# EAGLE schematic Pulsar 1.6 (EAGLE 5.11)

## Sheet 1 of 6
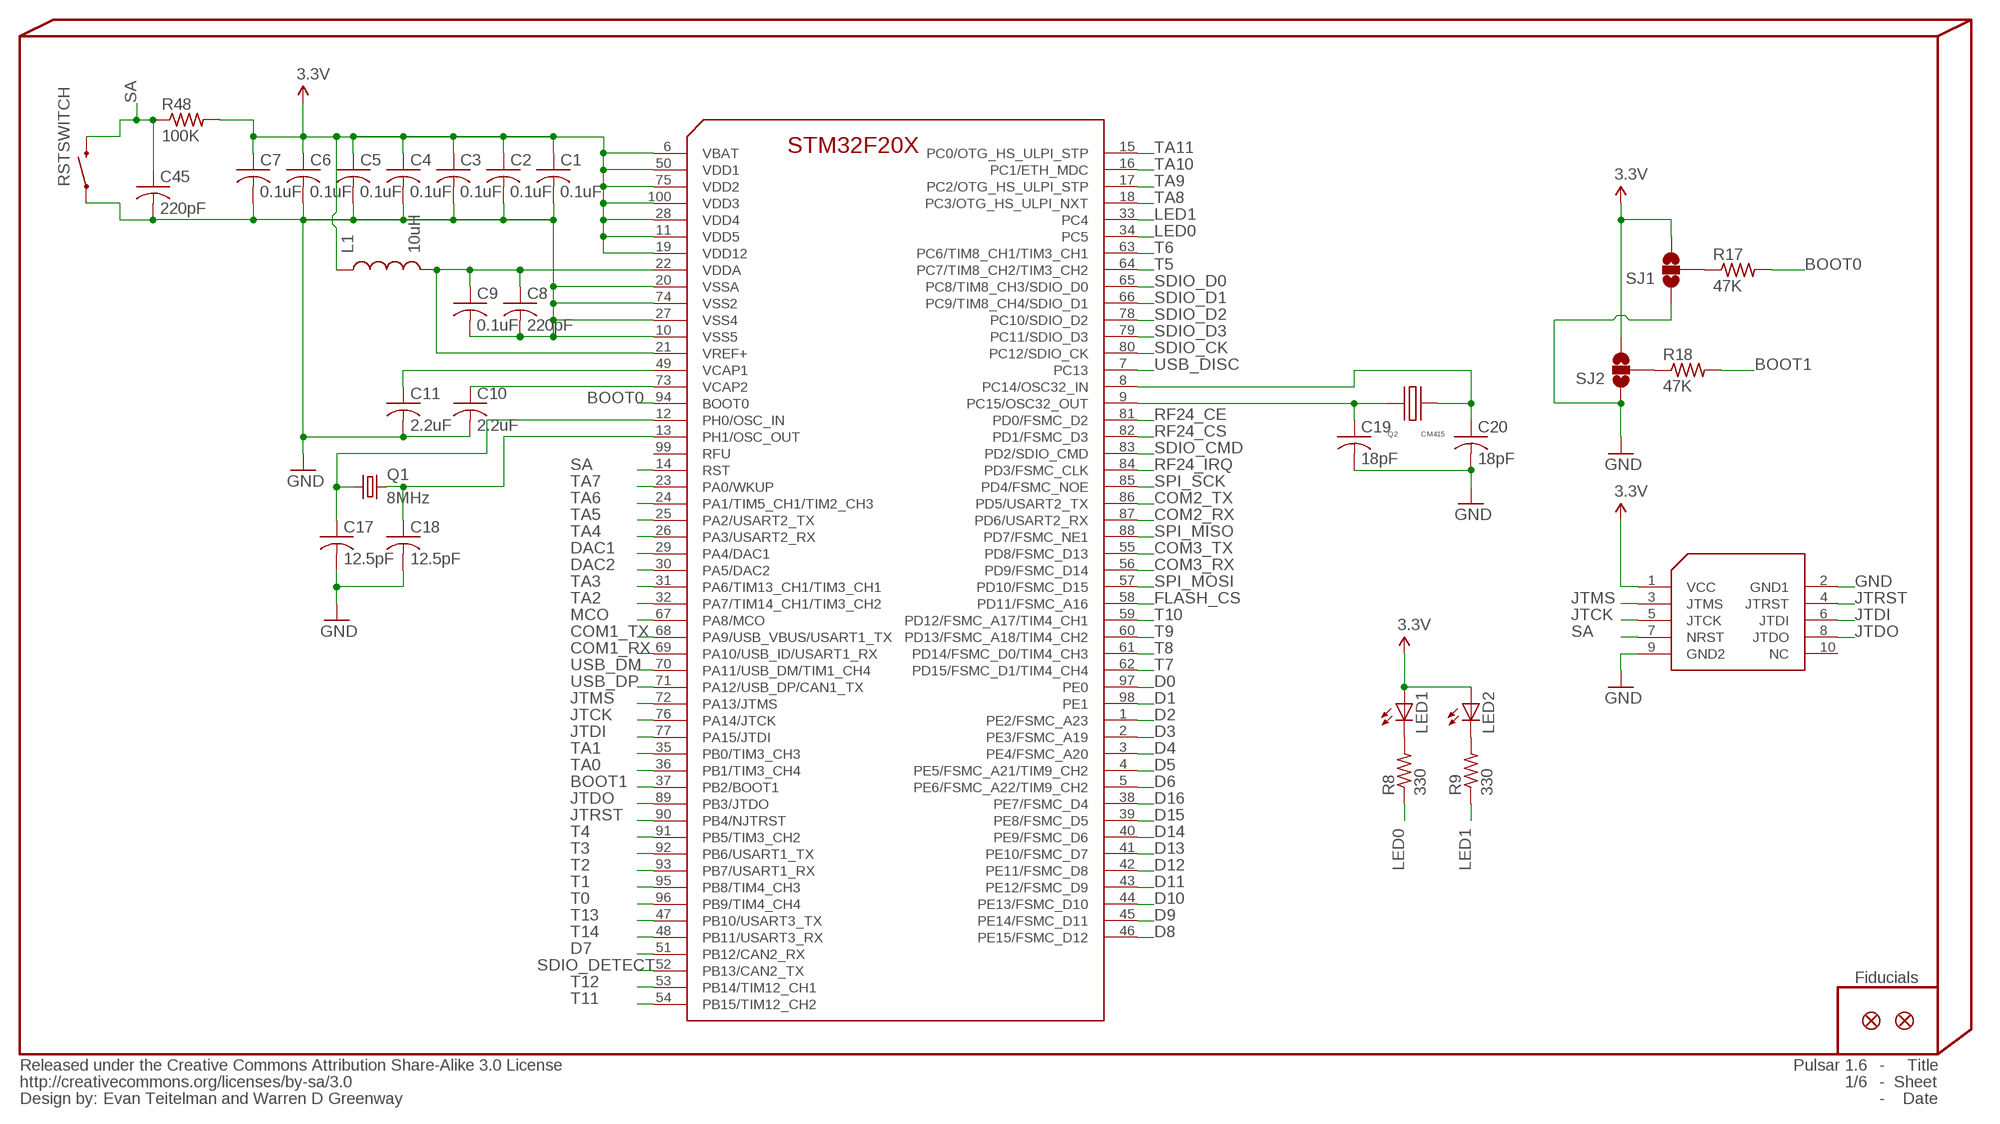
[diagram p0: schematic, sheet 1]

### Parts
C1  0.1uF  C-USC0402  [C0402]
C2  0.1uF  C-USC0402  [C0402]
C3  0.1uF  C-USC0402  [C0402]
C4  0.1uF  C-USC0402  [C0402]
C5  0.1uF  C-USC0402  [C0402]
C6  0.1uF  C-USC0402  [C0402]
C7  0.1uF  C-USC0402  [C0402]
C8  220pF  C-USC0402  [C0402]
C9  0.1uF  C-USC0402  [C0402]
C10  2.2uF  C-USC0402  [C0402]
C11  2.2uF  C-USC0402  [C0402]
C17  12.5pF  C-USC0402  [C0402]
C18  12.5pF  C-USC0402  [C0402]
C19  18pF  C-USC0402  [C0402]
C20  18pF  C-USC0402  [C0402]
C45  220pF  C-USC0402  [C0402]
INFO12  Evan Teitelman and Warren D Greenway  CC-BY-SA  [CC-BY-SA]
JP1  FIDUCIAL1.5X3  [FIDUCIAL-1.5X3]
JP2  FIDUCIAL1.5X3  [FIDUCIAL-1.5X3]
L1  10uH  INDUCTOR0805  [0805]
LED1  LED0603  [LED-0603]
LED2  LED0603  [LED-0603]
Q1  8MHz  CRYSTAL5X3  [CRYSTAL-SMD-5X3]
Q2  CM415  [CM415]
R8  330  R-US_R0402  [R0402]
R9  330  R-US_R0402  [R0402]
R17  47K  R-US_R0402  [R0402]
R18  47K  R-US_R0402  [R0402]
R48  100K  R-US_R0402  [R0402]
RSTSWITCH  SWITCH-MOMENTARY-2SMD  [TACTILE_SWITCH_SMD]
SJ1  SOLDERJUMPER_2WAYS  [SJ_3]
SJ2  SOLDERJUMPER_2WAYS  [SJ_3]
U1  STM32F205VG  [TQFP100]
U5  STM32-JTAG-10P  [STM32-JTAG-10P]

### Nets
3.3V: C1.1 C2.1 C3.1 C4.1 C5.1 C6.1 C7.1 L1.1 LED1.A LED2.A R48.2 SJ1.3 SJ2.3 U1.6(VBAT) U1.11(VDD5) U1.19(VDD12) U1.28(VDD4) U1.50(VDD1) U1.75(VDD2) U1.100(VDD3) U5.1(VCC) ; also sheet 2,3,4,5
BOOT0: R17.2 U1.94(BOOT0) ; also sheet 3
BOOT1: R18.2 U1.37(PB2/BOOT1) ; also sheet 3
COM1_RX: U1.69(PA10/USB_ID/USART1_RX) ; also sheet 3
COM1_TX: U1.68(PA9/USB_VBUS/USART1_TX) ; also sheet 3
COM2_RX: U1.87(PD6/USART2_RX) ; also sheet 3
COM2_TX: U1.86(PD5/USART2_TX) ; also sheet 3
COM3_RX: U1.56(PD9/FSMC_D14) ; also sheet 3
COM3_TX: U1.55(PD8/FSMC_D13) ; also sheet 3
D0: U1.97(PE0) ; also sheet 3
D1: U1.98(PE1) ; also sheet 3
D2: U1.1(PE2/FSMC_A23) ; also sheet 3
D3: U1.2(PE3/FSMC_A19) ; also sheet 3
D4: U1.3(PE4/FSMC_A20) ; also sheet 3
D5: U1.4(PE5/FSMC_A21/TIM9_CH2) ; also sheet 3
D6: U1.5(PE6/FSMC_A22/TIM9_CH2) ; also sheet 3
D7: U1.51(PB12/CAN2_RX) ; also sheet 3
D8: U1.46(PE15/FSMC_D12) ; also sheet 3
D9: U1.45(PE14/FSMC_D11) ; also sheet 3
D10: U1.44(PE13/FSMC_D10) ; also sheet 3
D11: U1.43(PE12/FSMC_D9) ; also sheet 3
D12: U1.42(PE11/FSMC_D8) ; also sheet 3
D13: U1.41(PE10/FSMC_D7) ; also sheet 3
D14: U1.40(PE9/FSMC_D6) ; also sheet 3
D15: U1.39(PE8/FSMC_D5) ; also sheet 3
D16: U1.38(PE7/FSMC_D4) ; also sheet 3
DAC1: U1.29(PA4/DAC1) ; also sheet 3
DAC2: U1.30(PA5/DAC2) ; also sheet 3
FLASH_CS: U1.58(PD11/FSMC_A16) ; also sheet 4
GND: C1.2 C2.2 C3.2 C4.2 C5.2 C6.2 C7.2 C8.2 C9.2 C10.2 C11.2 C17.2 C18.2 C19.2 C20.2 C45.2 RSTSWITCH.1 SJ1.1 SJ2.1 U1.10(VSS5) U1.20(VSSA) U1.27(VSS4) U1.74(VSS2) U5.2(GND1) U5.9(GND2) ; also sheet 2,3,4,5
JTCK: U1.76(PA14/JTCK) U5.5(JTCK) ; also sheet 3
JTDI: U1.77(PA15/JTDI) U5.6(JTDI) ; also sheet 3
JTDO: U1.89(PB3/JTDO) U5.8(JTDO) ; also sheet 3
JTMS: U1.72(PA13/JTMS) U5.3(JTMS) ; also sheet 3
JTRST: U1.90(PB4/NJTRST) U5.4(JTRST) ; also sheet 3
LED0: R8.1 U1.34(PC5)
LED1: R9.1 U1.33(PC4)
MCO: U1.67(PA8/MCO) ; also sheet 3
N$1: C17.1 Q1.1 U1.12(PH0/OSC_IN)
N$2: C8.1 C9.1 L1.2 U1.21(VREF+) U1.22(VDDA)
N$3: C18.1 Q1.3 U1.13(PH1/OSC_OUT)
N$6: C11.1 U1.49(VCAP1)
N$7: C10.1 U1.73(VCAP2)
N$8: C20.1 Q2.P$2(XOUT) U1.8(PC14/OSC32_IN)
N$9: C19.1 Q2.P$1(XIN) U1.9(PC15/OSC32_OUT)
N$10: LED1.C R8.2
N$12: LED2.C R9.2
N$30: R17.1 SJ1.2
N$31: R18.1 SJ2.2
RF24_CE: U1.81(PD0/FSMC_D2) ; also sheet 2
RF24_CS: U1.82(PD1/FSMC_D3) ; also sheet 2
RF24_IRQ: U1.84(PD3/FSMC_CLK) ; also sheet 2
SA: C45.1 R48.1 RSTSWITCH.3 U1.14(RST) U5.7(NRST) ; also sheet 3
SDIO_CK: U1.80(PC12/SDIO_CK) ; also sheet 4
SDIO_CMD: U1.83(PD2/SDIO_CMD) ; also sheet 4
SDIO_D0: U1.65(PC8/TIM8_CH3/SDIO_D0) ; also sheet 4
SDIO_D1: U1.66(PC9/TIM8_CH4/SDIO_D1) ; also sheet 4
SDIO_D2: U1.78(PC10/SDIO_D2) ; also sheet 4
SDIO_D3: U1.79(PC11/SDIO_D3) ; also sheet 4
SDIO_DETECT: U1.52(PB13/CAN2_TX) ; also sheet 4
SPI_MISO: U1.88(PD7/FSMC_NE1) ; also sheet 2,4
SPI_MOSI: U1.57(PD10/FSMC_D15) ; also sheet 2,4
SPI_SCK: U1.85(PD4/FSMC_NOE) ; also sheet 2,4
T0: U1.96(PB9/TIM4_CH4) ; also sheet 3
T1: U1.95(PB8/TIM4_CH3) ; also sheet 3
T2: U1.93(PB7/USART1_RX) ; also sheet 3
T3: U1.92(PB6/USART1_TX) ; also sheet 3
T4: U1.91(PB5/TIM3_CH2) ; also sheet 3
T5: U1.64(PC7/TIM8_CH2/TIM3_CH2) ; also sheet 3
T6: U1.63(PC6/TIM8_CH1/TIM3_CH1) ; also sheet 3
T7: U1.62(PD15/FSMC_D1/TIM4_CH4) ; also sheet 3
T8: U1.61(PD14/FSMC_D0/TIM4_CH3) ; also sheet 3
T9: U1.60(PD13/FSMC_A18/TIM4_CH2) ; also sheet 3
T10: U1.59(PD12/FSMC_A17/TIM4_CH1) ; also sheet 3
T11: U1.54(PB15/TIM12_CH2) ; also sheet 3
T12: U1.53(PB14/TIM12_CH1) ; also sheet 3
T13: U1.47(PB10/USART3_TX) ; also sheet 3
T14: U1.48(PB11/USART3_RX) ; also sheet 3
TA0: U1.36(PB1/TIM3_CH4) ; also sheet 3
TA1: U1.35(PB0/TIM3_CH3) ; also sheet 3
TA2: U1.32(PA7/TIM14_CH1/TIM3_CH2) ; also sheet 3
TA3: U1.31(PA6/TIM13_CH1/TIM3_CH1) ; also sheet 3
TA4: U1.26(PA3/USART2_RX) ; also sheet 3
TA5: U1.25(PA2/USART2_TX) ; also sheet 3
TA6: U1.24(PA1/TIM5_CH1/TIM2_CH3) ; also sheet 3
TA7: U1.23(PA0/WKUP) ; also sheet 3
TA8: U1.18(PC3/OTG_HS_ULPI_NXT) ; also sheet 3
TA9: U1.17(PC2/OTG_HS_ULPI_STP) ; also sheet 3
TA10: U1.16(PC1/ETH_MDC) ; also sheet 3
TA11: U1.15(PC0/OTG_HS_ULPI_STP) ; also sheet 3
USB_DISC: U1.7(PC13) ; also sheet 3,4
USB_DM: U1.70(PA11/USB_DM/TIM1_CH4) ; also sheet 3,4
USB_DP: U1.71(PA12/USB_DP/CAN1_TX) ; also sheet 3,4
Unconnected: U1.99(RFU) U5.10(NC)

### Notes on the sheet
- Fiducials

## Sheet 2 of 6
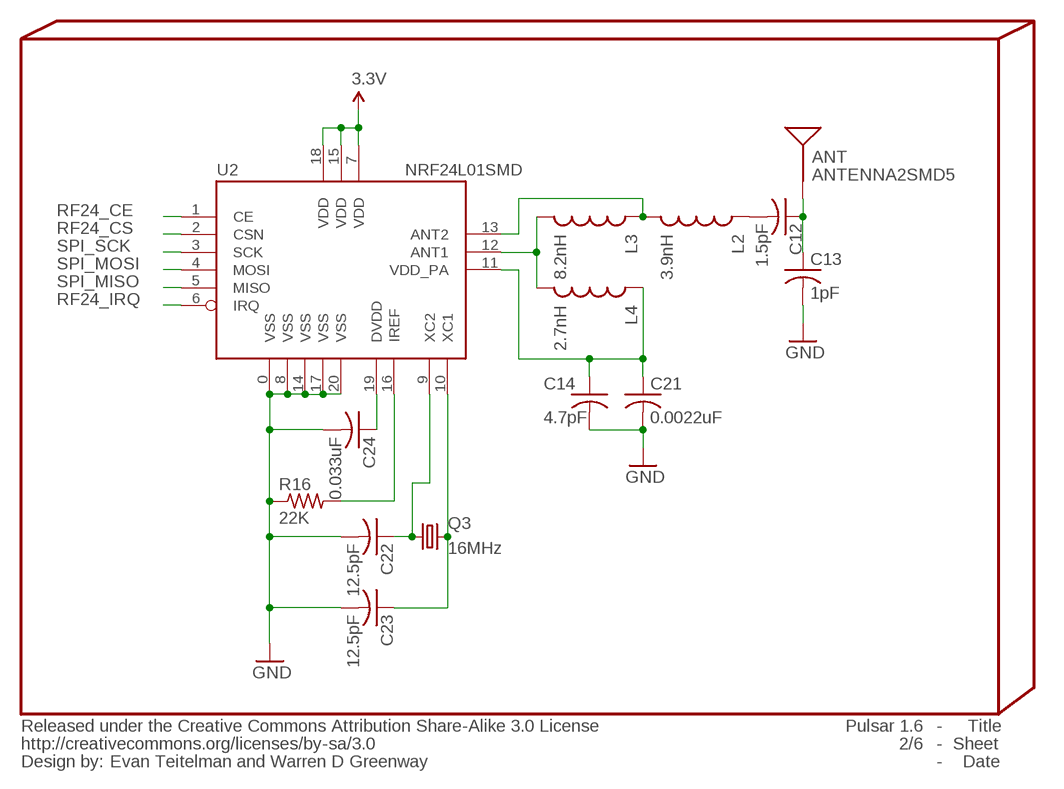
[diagram p1: schematic, sheet 2]

### Parts
ANT  ANTENNA2SMD5  [ANTENNA-CHIP5]
C12  1.5pF  C-USC0402  [C0402]
C13  1pF  C-USC0402  [C0402]
C14  4.7pF  C-USC0402  [C0402]
C21  0.0022uF  C-USC0402  [C0402]
C22  12.5pF  C-USC0402  [C0402]
C23  12.5pF  C-USC0402  [C0402]
C24  0.033uF  C-USC0402  [C0402]
L2  3.9nH  INDUCTOR0603  [0603]
L3  8.2nH  INDUCTOR0603  [0603]
L4  2.7nH  INDUCTOR0603  [0603]
Q3  16MHz  CRYSTAL5X3  [CRYSTAL-SMD-5X3]
R16  22K  R-US_R0402  [R0402]
U2  NRF24L01SMD  [QFN20]

### Nets
3.3V: U2.7(VDD) U2.15(VDD) U2.18(VDD) ; also sheet 1,3,4,5
GND: C13.2 C14.2 C21.2 C22.2 C23.2 C24.2 R16.1 U2.0(VSS) U2.8(VSS) U2.14(VSS) U2.17(VSS) U2.20(VSS) ; also sheet 1,3,4,5
N$17: C12.2 L2.1
N$18: L3.2 L4.2 U2.12(ANT1)
N$19: ANT.FEED(SIGNAL) C12.1 C13.1
N$20: L2.2 L3.1 U2.13(ANT2)
N$21: C14.1 C21.1 L4.1 U2.11(VDD_PA)
N$23: R16.2 U2.16(IREF)
N$24: C24.1 U2.19(DVDD)
N$26: C22.1 Q3.1 U2.9(XC2)
N$27: C23.1 Q3.3 U2.10(XC1)
RF24_CE: U2.1(CE) ; also sheet 1
RF24_CS: U2.2(CSN) ; also sheet 1
RF24_IRQ: U2.6(IRQ) ; also sheet 1
SPI_MISO: U2.5(MISO) ; also sheet 1,4
SPI_MOSI: U2.4(MOSI) ; also sheet 1,4
SPI_SCK: U2.3(SCK) ; also sheet 1,4

## Sheet 3 of 6
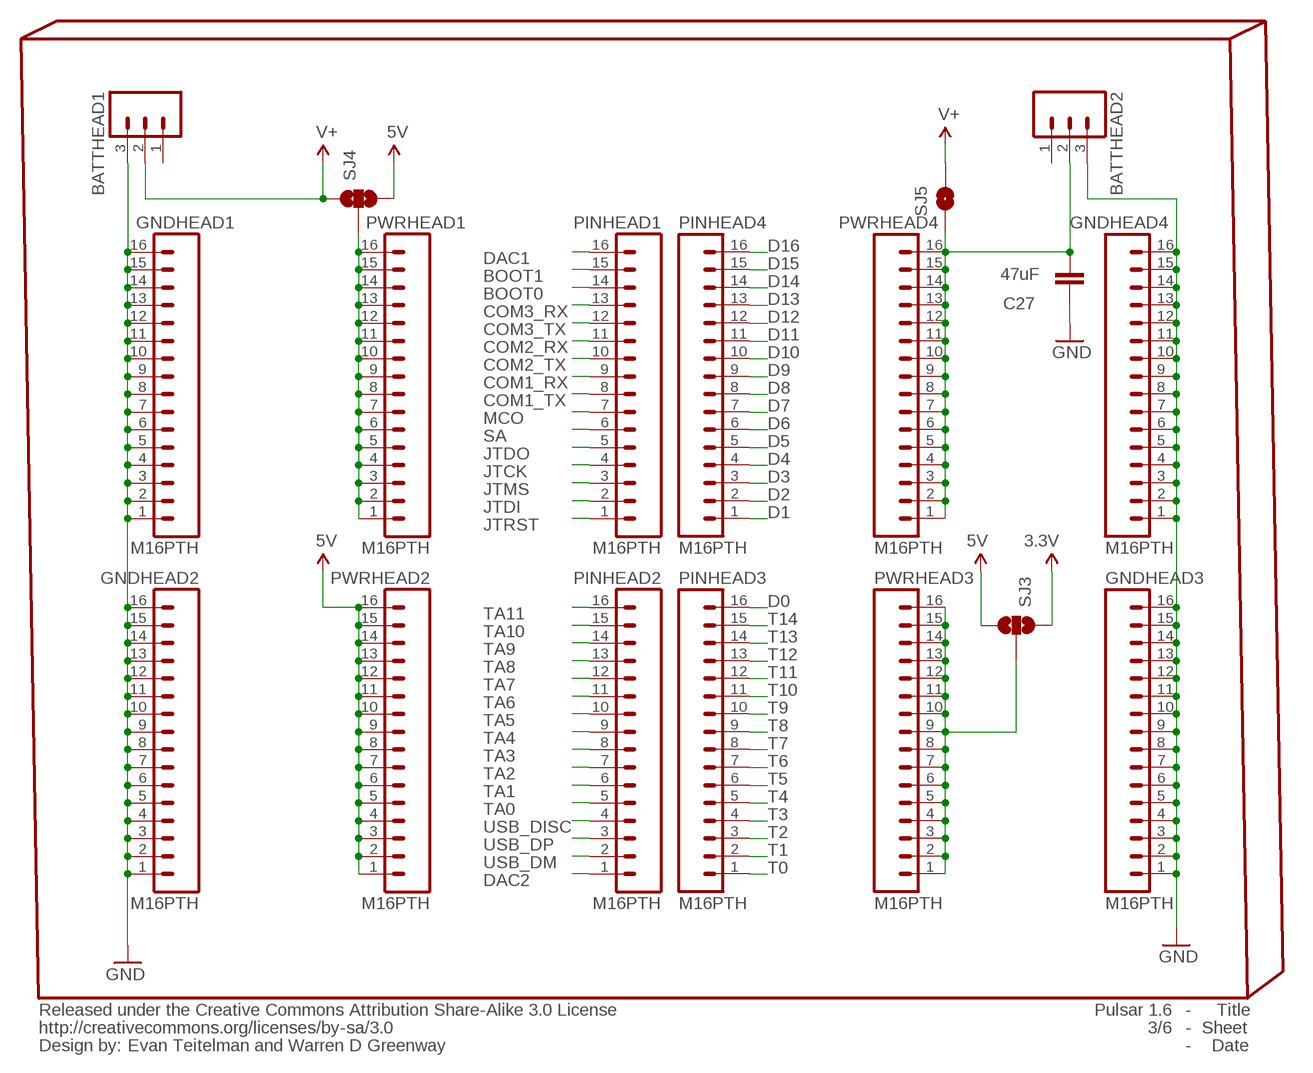
[diagram p2: schematic, sheet 3]

### Parts
BATTHEAD1  M03PTH  [1X03]
BATTHEAD2  M03PTH  [1X03]
C27  47uF  CAP1206  [1206]
GNDHEAD1  M16PTH  [1X16]
GNDHEAD2  M16PTH  [1X16]
GNDHEAD3  M16PTH  [1X16]
GNDHEAD4  M16PTH  [1X16]
PINHEAD1  M16PTH  [1X16]
PINHEAD2  M16PTH  [1X16]
PINHEAD3  M16PTH  [1X16]
PINHEAD4  M16PTH  [1X16]
PWRHEAD1  M16PTH  [1X16]
PWRHEAD2  M16PTH  [1X16]
PWRHEAD3  M16PTH  [1X16]
PWRHEAD4  M16PTH  [1X16]
SJ3  SOLDERJUMPER_2WAYPASTE1&2  [SJ_3_PASTE1&2]
SJ4  SOLDERJUMPER_2WAYPASTE1&2  [SJ_3_PASTE1&2]
SJ5  SOLDERJUMPERNO  [SJ_2S-NO]

### Nets
3.3V: SJ3.1 ; also sheet 1,2,4,5
5V: PWRHEAD2.1 PWRHEAD2.2 PWRHEAD2.3 PWRHEAD2.4 PWRHEAD2.5 PWRHEAD2.6 PWRHEAD2.7 PWRHEAD2.8 PWRHEAD2.9 PWRHEAD2.10 PWRHEAD2.11 PWRHEAD2.12 PWRHEAD2.13 PWRHEAD2.14 PWRHEAD2.15 PWRHEAD2.16 SJ3.3 SJ4.3 ; also sheet 4,5
BOOT0: PINHEAD1.14 ; also sheet 1
BOOT1: PINHEAD1.15 ; also sheet 1
COM1_RX: PINHEAD1.9 ; also sheet 1
COM1_TX: PINHEAD1.8 ; also sheet 1
COM2_RX: PINHEAD1.11 ; also sheet 1
COM2_TX: PINHEAD1.10 ; also sheet 1
COM3_RX: PINHEAD1.13 ; also sheet 1
COM3_TX: PINHEAD1.12 ; also sheet 1
D0: PINHEAD3.16 ; also sheet 1
D1: PINHEAD4.1 ; also sheet 1
D2: PINHEAD4.2 ; also sheet 1
D3: PINHEAD4.3 ; also sheet 1
D4: PINHEAD4.4 ; also sheet 1
D5: PINHEAD4.5 ; also sheet 1
D6: PINHEAD4.6 ; also sheet 1
D7: PINHEAD4.7 ; also sheet 1
D8: PINHEAD4.8 ; also sheet 1
D9: PINHEAD4.9 ; also sheet 1
D10: PINHEAD4.10 ; also sheet 1
D11: PINHEAD4.11 ; also sheet 1
D12: PINHEAD4.12 ; also sheet 1
D13: PINHEAD4.13 ; also sheet 1
D14: PINHEAD4.14 ; also sheet 1
D15: PINHEAD4.15 ; also sheet 1
D16: PINHEAD4.16 ; also sheet 1
DAC1: PINHEAD1.16 ; also sheet 1
DAC2: PINHEAD2.1 ; also sheet 1
GND: BATTHEAD1.3 BATTHEAD2.3 C27.2 GNDHEAD1.1 GNDHEAD1.2 GNDHEAD1.3 GNDHEAD1.4 GNDHEAD1.5 GNDHEAD1.6 GNDHEAD1.7 GNDHEAD1.8 GNDHEAD1.9 GNDHEAD1.10 GNDHEAD1.11 GNDHEAD1.12 GNDHEAD1.13 GNDHEAD1.14 GNDHEAD1.15 GNDHEAD1.16 GNDHEAD2.1 GNDHEAD2.2 GNDHEAD2.3 GNDHEAD2.4 GNDHEAD2.5 GNDHEAD2.6 GNDHEAD2.7 GNDHEAD2.8 GNDHEAD2.9 GNDHEAD2.10 GNDHEAD2.11 GNDHEAD2.12 GNDHEAD2.13 GNDHEAD2.14 GNDHEAD2.15 GNDHEAD2.16 GNDHEAD3.1 GNDHEAD3.2 GNDHEAD3.3 GNDHEAD3.4 GNDHEAD3.5 GNDHEAD3.6 GNDHEAD3.7 GNDHEAD3.8 GNDHEAD3.9 GNDHEAD3.10 GNDHEAD3.11 GNDHEAD3.12 GNDHEAD3.13 GNDHEAD3.14 GNDHEAD3.15 GNDHEAD3.16 GNDHEAD4.1 GNDHEAD4.2 GNDHEAD4.3 GNDHEAD4.4 GNDHEAD4.5 GNDHEAD4.6 GNDHEAD4.7 GNDHEAD4.8 GNDHEAD4.9 GNDHEAD4.10 GNDHEAD4.11 GNDHEAD4.12 GNDHEAD4.13 GNDHEAD4.14 GNDHEAD4.15 GNDHEAD4.16 ; also sheet 1,2,4,5
JTCK: PINHEAD1.4 ; also sheet 1
JTDI: PINHEAD1.2 ; also sheet 1
JTDO: PINHEAD1.5 ; also sheet 1
JTMS: PINHEAD1.3 ; also sheet 1
JTRST: PINHEAD1.1 ; also sheet 1
MCO: PINHEAD1.7 ; also sheet 1
PH1LINE: PWRHEAD1.1 PWRHEAD1.2 PWRHEAD1.3 PWRHEAD1.4 PWRHEAD1.5 PWRHEAD1.6 PWRHEAD1.7 PWRHEAD1.8 PWRHEAD1.9 PWRHEAD1.10 PWRHEAD1.11 PWRHEAD1.12 PWRHEAD1.13 PWRHEAD1.14 PWRHEAD1.15 PWRHEAD1.16 SJ4.2
PH3LINE: PWRHEAD3.1 PWRHEAD3.2 PWRHEAD3.3 PWRHEAD3.4 PWRHEAD3.5 PWRHEAD3.6 PWRHEAD3.7 PWRHEAD3.8 PWRHEAD3.9 PWRHEAD3.10 PWRHEAD3.11 PWRHEAD3.12 PWRHEAD3.13 PWRHEAD3.14 PWRHEAD3.15 PWRHEAD3.16 SJ3.2
PH4LINE: BATTHEAD2.2 C27.1 PWRHEAD4.1 PWRHEAD4.2 PWRHEAD4.3 PWRHEAD4.4 PWRHEAD4.5 PWRHEAD4.6 PWRHEAD4.7 PWRHEAD4.8 PWRHEAD4.9 PWRHEAD4.10 PWRHEAD4.11 PWRHEAD4.12 PWRHEAD4.13 PWRHEAD4.14 PWRHEAD4.15 PWRHEAD4.16 SJ5.1
SA: PINHEAD1.6 ; also sheet 1
T0: PINHEAD3.1 ; also sheet 1
T1: PINHEAD3.2 ; also sheet 1
T2: PINHEAD3.3 ; also sheet 1
T3: PINHEAD3.4 ; also sheet 1
T4: PINHEAD3.5 ; also sheet 1
T5: PINHEAD3.6 ; also sheet 1
T6: PINHEAD3.7 ; also sheet 1
T7: PINHEAD3.8 ; also sheet 1
T8: PINHEAD3.9 ; also sheet 1
T9: PINHEAD3.10 ; also sheet 1
T10: PINHEAD3.11 ; also sheet 1
T11: PINHEAD3.12 ; also sheet 1
T12: PINHEAD3.13 ; also sheet 1
T13: PINHEAD3.14 ; also sheet 1
T14: PINHEAD3.15 ; also sheet 1
TA0: PINHEAD2.5 ; also sheet 1
TA1: PINHEAD2.6 ; also sheet 1
TA2: PINHEAD2.7 ; also sheet 1
TA3: PINHEAD2.8 ; also sheet 1
TA4: PINHEAD2.9 ; also sheet 1
TA5: PINHEAD2.10 ; also sheet 1
TA6: PINHEAD2.11 ; also sheet 1
TA7: PINHEAD2.12 ; also sheet 1
TA8: PINHEAD2.13 ; also sheet 1
TA9: PINHEAD2.14 ; also sheet 1
TA10: PINHEAD2.15 ; also sheet 1
TA11: PINHEAD2.16 ; also sheet 1
USB_DISC: PINHEAD2.4 ; also sheet 1,4
USB_DM: PINHEAD2.2 ; also sheet 1,4
USB_DP: PINHEAD2.3 ; also sheet 1,4
V+: BATTHEAD1.2 SJ4.1 SJ5.2 ; also sheet 5
Unconnected: BATTHEAD1.1 BATTHEAD2.1

## Sheet 4 of 6
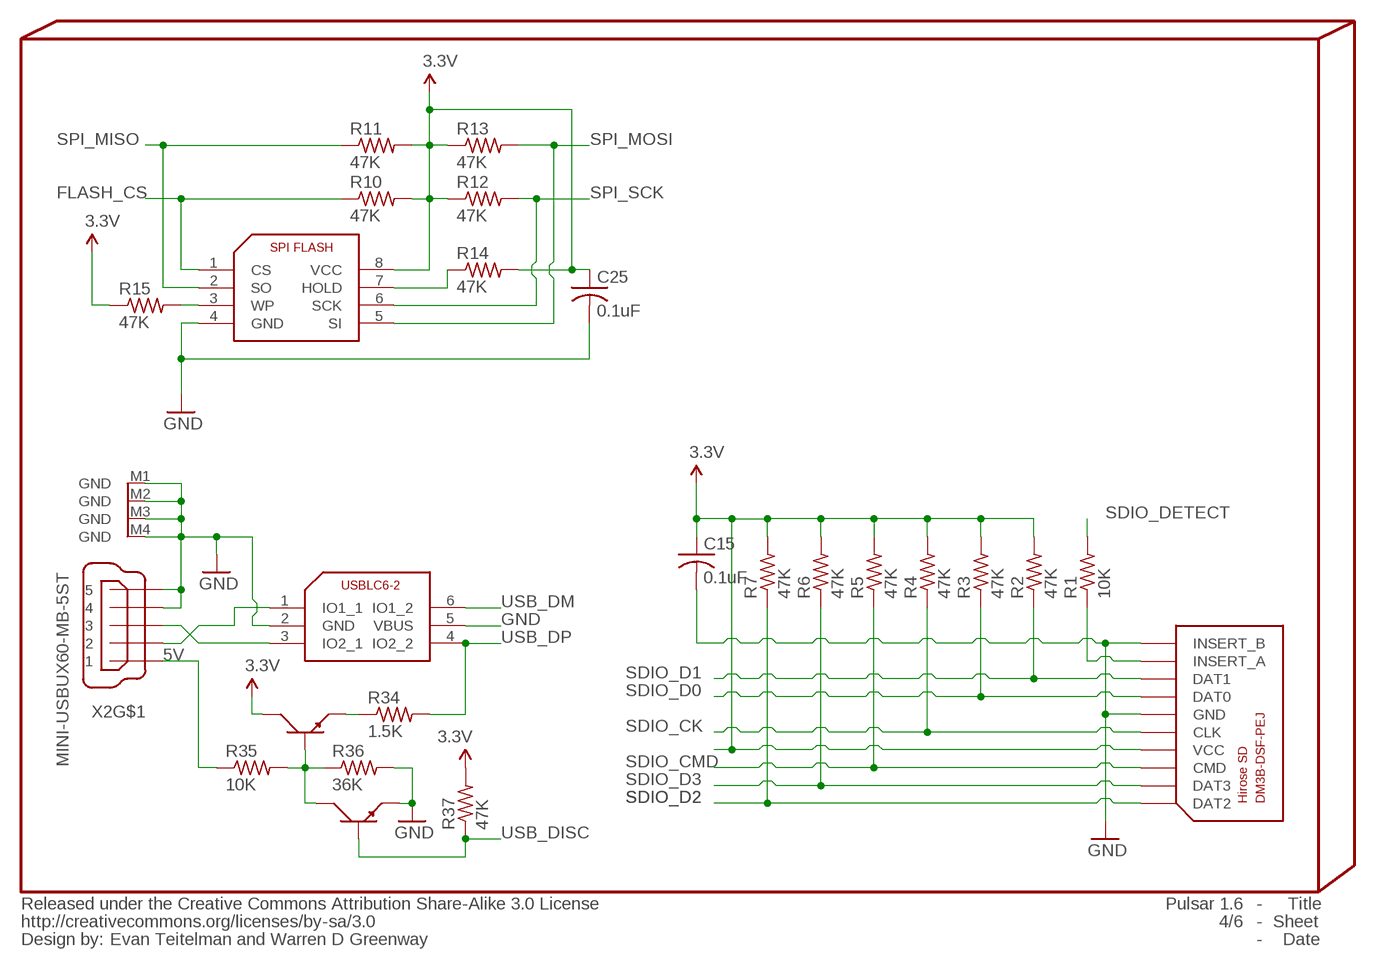
[diagram p3: schematic, sheet 4]

### Parts
C15  0.1uF  C-USC0402  [C0402]
C25  0.1uF  C-USC0402  [C0402]
R1  10K  R-US_R0402  [R0402]
R2  47K  R-US_R0402  [R0402]
R3  47K  R-US_R0402  [R0402]
R4  47K  R-US_R0402  [R0402]
R5  47K  R-US_R0402  [R0402]
R6  47K  R-US_R0402  [R0402]
R7  47K  R-US_R0402  [R0402]
R10  47K  R-US_R0402  [R0402]
R11  47K  R-US_R0402  [R0402]
R12  47K  R-US_R0402  [R0402]
R13  47K  R-US_R0402  [R0402]
R14  47K  R-US_R0402  [R0402]
R15  47K  R-US_R0402  [R0402]
R34  1.5K  R-US_R0402  [R0402]
R35  10K  R-US_R0402  [R0402]
R36  36K  R-US_R0402  [R0402]
R37  47K  R-US_R0402  [R0402]
U3  SST25VF080B  [DUBLIB_SOIC8]
U4  USBLC6-2  [SOT23-6L]
U6  HIROSE-SDCARD-DM3B-DSF-PEJ  [HIROSE-SDCARD-DM3B-DSF-PEJ]
U$23  PMBT6428  [SOT23]
U$24  PMBT6428  [SOT23]
X2  MINI-USBUX60-MB-5ST  [DUBLIB_UX60-MB-5ST]

### Nets
3.3V: C15.1 C25.1 R2.2 R3.2 R4.2 R5.2 R6.2 R7.2 R10.2 R11.2 R12.1 R13.1 R14.2 R15.1 R37.2 U3.8(VCC) U6.P$4(VCC) U$23.3 ; also sheet 1,2,3,5
5V: R35.1 X2.1 ; also sheet 3,5
FLASH_CS: R10.1 U3.1(CS) ; also sheet 1
GND: C15.2 C25.2 R36.2 U3.4(GND) U4.2(GND) U4.5(VBUS) U6.P$6(GND) U6.P$11(INSERT_B) U$24.2 X2.4 X2.5 X2.M1(GND) X2.M2(GND) X2.M3(GND) X2.M4(GND) ; also sheet 1,2,3,5
N$4: R35.2 R36.1 U$23.1 U$24.3
N$11: R1.1 U6.P$9(INSERT_A)
N$25: R34.1 U$23.2
N$28: R15.2 U3.3(WP)
N$29: R14.1 U3.7(HOLD)
N$38: U4.1(IO1_1) X2.2
SDIO_CK: R4.1 U6.P$5(CLK) ; also sheet 1
SDIO_CMD: R5.1 U6.P$3(CMD) ; also sheet 1
SDIO_D0: R3.1 U6.P$7(DAT0) ; also sheet 1
SDIO_D1: R2.1 U6.P$8(DAT1) ; also sheet 1
SDIO_D2: R7.1 U6.P$1(DAT2) ; also sheet 1
SDIO_D3: R6.1 U6.P$2(DAT3) ; also sheet 1
SDIO_DETECT: R1.2 ; also sheet 1
SPI_MISO: R11.1 U3.2(SO) ; also sheet 1,2
SPI_MOSI: R13.2 U3.5(SI) ; also sheet 1,2
SPI_SCK: R12.2 U3.6(SCK) ; also sheet 1,2
USB_DISC: R37.1 U$24.1 ; also sheet 1,3
USB_DM: U4.6(IO1_2) ; also sheet 1,3
USB_DP: R34.2 U4.4(IO2_2) ; also sheet 1,3
USBP3: U4.3(IO2_1) X2.3

## Sheet 5 of 6
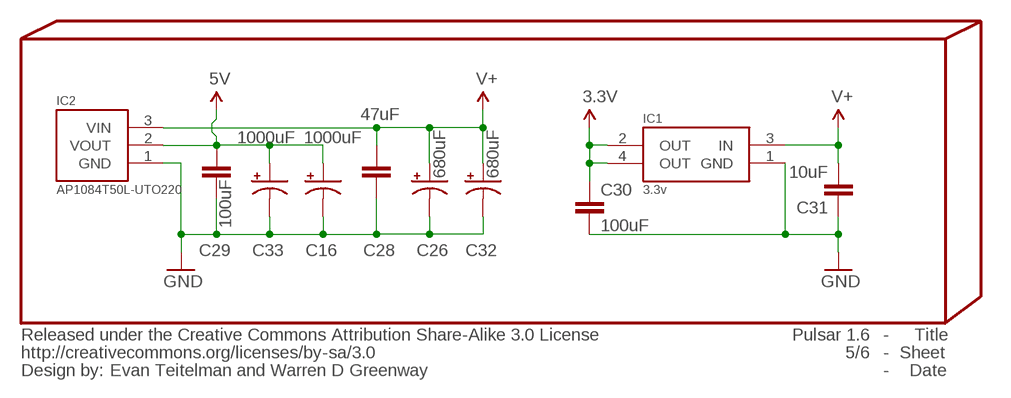
[diagram p4: schematic, sheet 5]

### Parts
C16  1000uF  CAP_POLE  [PANASONIC_E]
C26  680uF  CAP_POLE  [PANASONIC_E]
C28  47uF  CAP1206  [1206]
C29  100uF  CAP1210  [1210]
C30  100uF  CAP1210  [1210]
C31  10uF  CAP0805  [0805]
C32  680uF  CAP_POLE  [PANASONIC_E]
C33  1000uF  CAP_POLE  [PANASONIC_E]
IC1  3.3v  TLV111  [SOT223]
IC2  AP1084T50L-UTO220  [TO220V]

### Nets
3.3V: C30.1 IC1.2(OUT) IC1.4(OUT) ; also sheet 1,2,3,4
5V: C16.+ C29.1 C33.+ IC2.2(VOUT) ; also sheet 3,4
GND: C16.- C26.- C28.2 C29.2 C30.2 C31.1 C32.- C33.- IC1.1(GND) IC2.1(GND) ; also sheet 1,2,3,4
V+: C26.+ C28.1 C31.2 C32.+ IC1.3(IN) IC2.3(VIN) ; also sheet 3

## Sheet 6 of 6
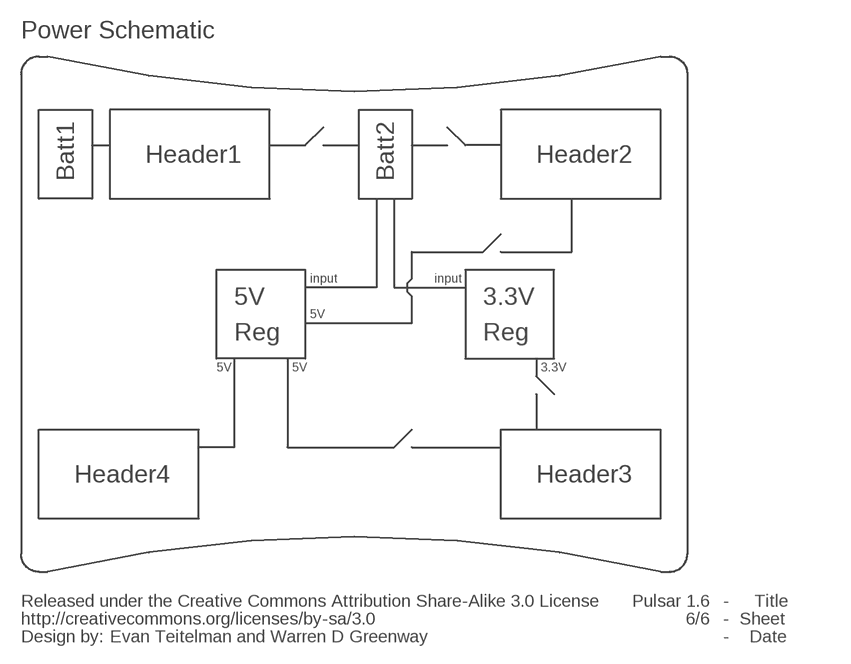
[diagram p5: schematic, sheet 6]

### Notes on the sheet
- Power Schematic
- Header1 | Header2
- Batt1 | Batt2
- input | input
- 5V | 3.3V
- 5V
- Reg | Reg
- 5V | 5V | 3.3V
- Header4 | Header3

## Power pins joined to a net without a drawn wire
GND: U6.P$12(GND) U6.P$13(GND) U6.P$14(GND)

## Library data of the parts
ANT = Pygmy:ANTENNA2: Antenna Single endded antenna. Common with smaller chip antennas. CHIP4 package is the GPS Chip Antenna SKU: GPS-08418. CHIP5 package is 2.4GHz chip antenna SKU: WRL-00144.
BATTHEAD1 BATTHEAD2 = SparkFun:M03: Header 3 Standard 3-pin 0.1" header. Use with straight break away headers (SKU : PRT-00116), right angle break away headers (PRT-00553), swiss pins (PRT-00743), machine pins (PRT-00117), and female headers (PRT-00115). Molex polarized connector foot print use with SKU : PRT-08232 with associated crimp pins and housings.
C1-C15 C17-C25 C45 = rcl:C-US: CAPACITOR, American symbol
C16 C26 C32 C33 = SparkFun:CAP_POL: Capacitor Polarized These are standard SMD and PTH capacitors. Normally 10uF, 47uF, and 100uF in electrolytic and tantalum varieties. Always verify the external diameter of the through hole cap, it varies with capacity, voltage, and manufacturer. The EIA devices should be standard.
C27-C31 = SparkFun:CAP: Capacitor Standard 0603 ceramic capacitor, and 0.1" leaded capacitor.
GNDHEAD1-GNDHEAD4 PINHEAD1-PINHEAD4 PWRHEAD1-PWRHEAD4 = Pygmy:M16
IC1 = Custom12:TLV111
IC2 = Custom12:AP1084T50L-U
INFO12 = EagleLbr:CC-BY-SA: Creative Commons Attribution-ShareAlike License <http://creativecommons.org/licenses/by-sa/3.0/>
JP1 JP2 = SparkFun:FIDUCIAL: Fiducial Alignment Points Various fiducial points for machine vision alignment.
L1 = SparkFun:INDUCTOR: Inductors Basic Inductor/Choke - 0603 and 1206. Footprints are not proven and vary greatly between part numbers.
L2-L4 = Pygmy:INDUCTOR: Inductors Basic Inductor/Choke - 0603 and 1206. Footprints are not proven and vary greatly between part numbers.
LED1 LED2 = Pygmy:LED: LEDs Standard schematic elements and footprints for 5mm, 3mm, 1206, and 0603 sized LEDs. 5mm - Spark Fun Electronics SKU : COM-00529 (and others)
Q1 Q3 = Pygmy:CRYSTAL: Crystals Various standard crystals. Proven footprints. Spark Fun Electronics SKU : COM-00534
Q2 = Pygmy:CM415
R1-R18 R34-R37 R48 = rcl:R-US_: RESISTOR, American symbol
RSTSWITCH = SparkFun:SWITCH-MOMENTARY-2
SJ1-SJ4 = Pygmy:SOLDERJUMPER_2WAY: Solder Jumper 2 way solder jumper
SJ5 = Pygmy:SOLDERJUMPER: Solder Jumper Standard SMD solder jumper. Used to automate production. Two varients : Normally Open and Normally Closed are the same, but have different paste layers. NC will have a large amount of paste and should jumper during reflow.
U1 = Pygmy:STM32F205VG
U2 = Pygmy:NRF24L01: 2.4GHz Low Power Transceiver This is the very popular, low cost, very low power RF transceiver from Nordic Semiconductor. Simple SPI interface. SKU: COM-00690
U3 = Pygmy:SST25VF080B
U4 = Pygmy:USBLC6-2
U5 = Pygmy:STM32-JTAG-10P
U6 = Pygmy:HIROSE-SDCARD-DM3B-DSF-PEJ
U$23 U$24 = dublib:PMBT6428
X2 = Pygmy:MINI-USB: MINI USB Connector Source: http://www.hirose.co.jp/cataloge_hp/e24000019.pdf